# Altium schematic sheet ADS1248.SchDoc
size A4
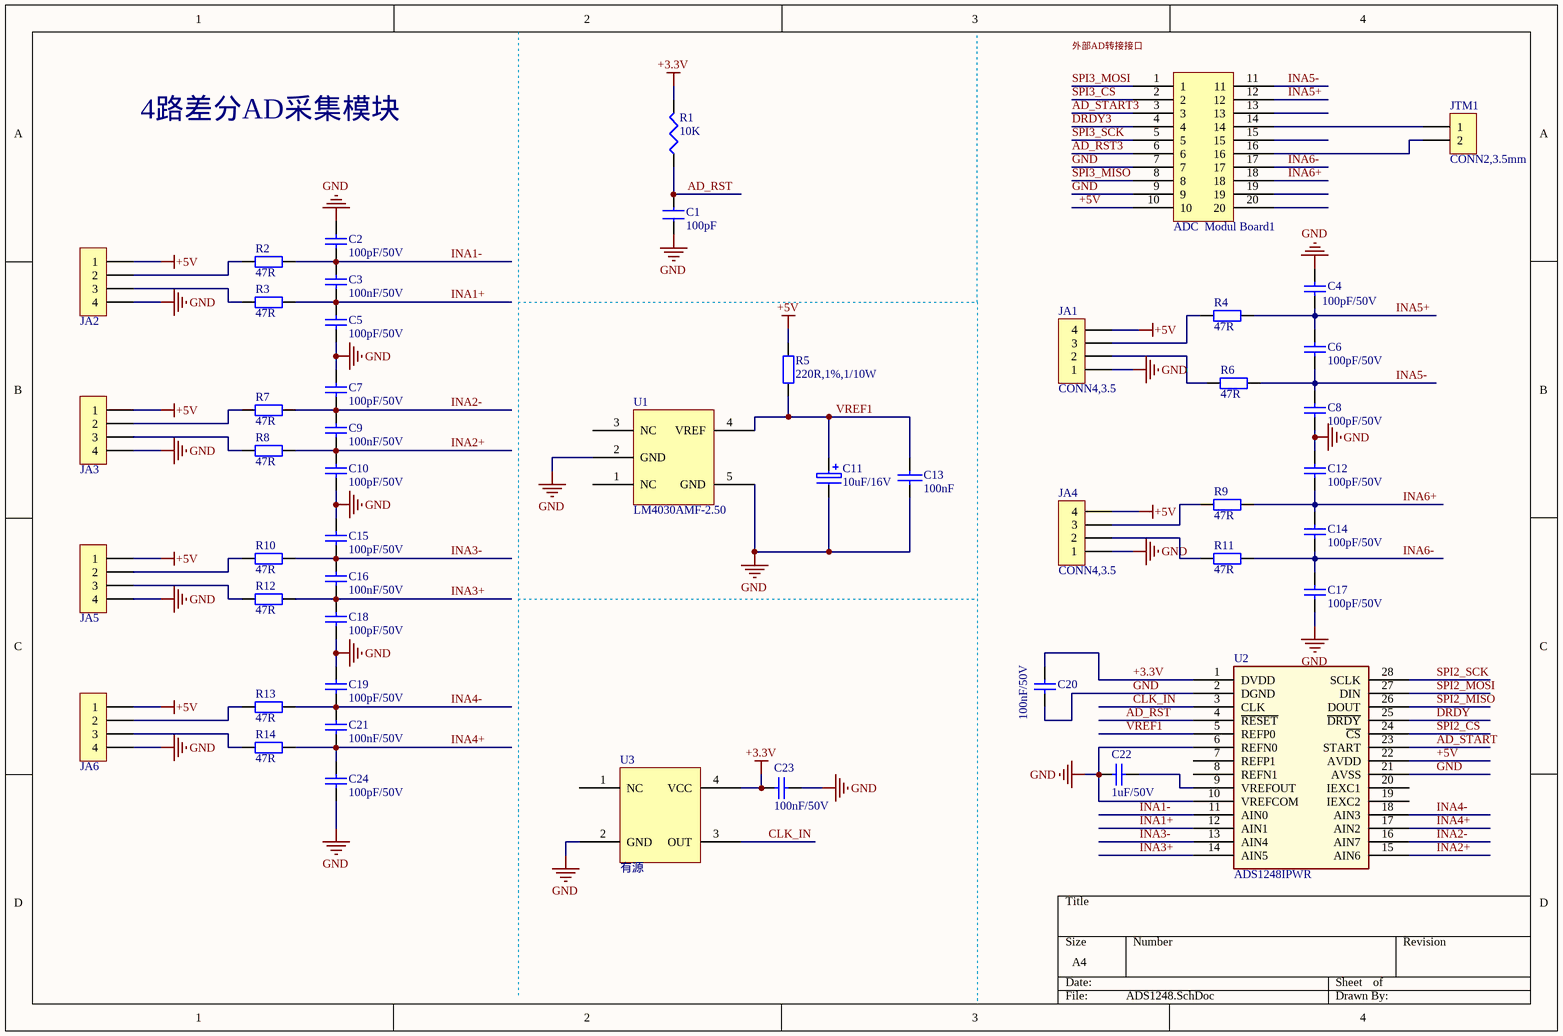
[diagram p0: ADS1248.SchDoc]

## Parts
ADC_Modul_Board1  ADC  Modul Board  [ADC  Modul Board]  (value not drawn)
C1  100pF  [0603C]
C2  100pF/50V  [0603C]
C3  100nF/50V  [0603C]
C4  100pF/50V  [0603C]
C5  100pF/50V  [0603C]
C6  100pF/50V  [0603C]
C7  100pF/50V  [0603C]
C8  100pF/50V  [0603C]
C9  100nF/50V  [0603C]
C10  100pF/50V  [0603C]
C11  10uF/16V  [3216]
C12  100pF/50V  [0603C]
C13  100nF  [0603C]
C14  100pF/50V  [0603C]
C15  100pF/50V  [0603C]
C16  100nF/50V  [0603C]
C17  100pF/50V  [0603C]
C18  100pF/50V  [0603C]
C19  100pF/50V  [0603C]
C20  100nF/50V  [0603C]
C21  100nF/50V  [0603C]
C22  1uF/50V  [0603C]
C23  100nF/50V  [0603C]
C24  100pF/50V  [0603C]
JA1  CONN4,3.5  [CN4-3.5]
JA2  XH-4A  [CN4-3.5]  (value not drawn)
JA3  XH-4A  [CN4-3.5]  (value not drawn)
JA4  CONN4,3.5  [CN4-3.5]
JA5  XH-4A  [CN4-3.5]  (value not drawn)
JA6  XH-4A  [CN4-3.5]  (value not drawn)
JTM1  CONN2,3.5mm  [KF124-2P-3.5]
R1  10K  [0603R]
R2  47R  [0603R]
R3  47R  [0603R]
R4  47R  [0603R]
R5  220R,1%,1/10W  [0603R]
R6  47R  [0603R]
R7  47R  [0603R]
R8  47R  [0603R]
R9  47R  [0603R]
R10  47R  [0603R]
R11  47R  [0603R]
R12  47R  [0603R]
R13  47R  [0603R]
R14  47R  [0603R]
U1  LM4030AMF-2.50  [SOT23-5]
U2  ADS1248IPWR  [SSOP28]
U3  有源  [ECS-3953C]

## Nets
+3.3V: C20.2 C23.2 R1.2 U2.1(DVDD) U3.4(VCC)
+5V: ADC_Modul_Board1.10 JA1.4 JA2.1 JA3.1 JA4.4 JA5.1 JA6.1 R5.1 U2.22(AVDD)
GND: ADC_Modul_Board1.7 ADC_Modul_Board1.9 C1.2 C2.2 C4.2 C5.1 C7.2 C8.1 C10.1 C11.2 C12.2 C13.2 C15.2 C17.1 C18.1 C19.2 C20.1 C22.1 C23.1 C24.1 JA1.1 JA2.4 JA3.4 JA4.1 JA5.4 JA6.4 U1.2(GND) U1.5(GND) U2.2(DGND) U2.6(REFN0) U2.10(VREFCOM) U2.21(AVSS) U3.2(GND)
AD_RST: C1.1 R1.1 U2.4(~{RESET})
AD_RST3: ADC_Modul_Board1.6
AD_START: U2.23(START)
AD_START3: ADC_Modul_Board1.3
CLK_IN: U2.3(CLK) U3.3(OUT)
DRDY: U2.25(~{DRDY})
DRDY3: ADC_Modul_Board1.4
INA1+: C3.1 C5.2 R3.2 U2.12(AIN1)
INA1-: C2.1 C3.2 R2.2 U2.11(AIN0)
INA2+: C9.1 C10.2 R8.2 U2.15(AIN6)
INA2-: C7.1 C9.2 R7.2 U2.16(AIN7)
INA3+: C16.1 C18.2 R12.2 U2.14(AIN5)
INA3-: C15.1 C16.2 R10.2 U2.13(AIN4)
INA4+: C21.1 C24.2 R14.2 U2.17(AIN2)
INA4-: C19.1 C21.2 R13.2 U2.18(AIN3)
INA5+: ADC_Modul_Board1.12 C4.1 C6.2 R4.2
INA5-: ADC_Modul_Board1.11 C6.1 C8.2 R6.2
INA6+: ADC_Modul_Board1.18 C12.1 C14.2 R9.2
INA6-: ADC_Modul_Board1.17 C14.1 C17.2 R11.2
SPI2_CS: U2.24(~{CS})
SPI2_MISO: U2.26(DOUT)
SPI2_MOSI: U2.27(DIN)
SPI2_SCK: U2.28(SCLK)
SPI3_CS: ADC_Modul_Board1.2
SPI3_MISO: ADC_Modul_Board1.8
SPI3_MOSI: ADC_Modul_Board1.1
SPI3_SCK: ADC_Modul_Board1.5
VREF1: C11.1 C13.1 R5.2 U1.4(VREF) U2.5(REFP0)
NetADC_Modul_Board1_14: ADC_Modul_Board1.14 JTM1.1
NetADC_Modul_Board1_16: ADC_Modul_Board1.16 JTM1.2
NetC22_2: C22.2 U2.9(VREFOUT)
NetJA1_2: JA1.2 R6.1
NetJA1_3: JA1.3 R4.1
NetJA2_2: JA2.2 R2.1
NetJA2_3: JA2.3 R3.1
NetJA3_2: JA3.2 R7.1
NetJA3_3: JA3.3 R8.1
NetJA4_2: JA4.2 R11.1
NetJA4_3: JA4.3 R9.1
NetJA5_2: JA5.2 R10.1
NetJA5_3: JA5.3 R12.1
NetJA6_2: JA6.2 R13.1
NetJA6_3: JA6.3 R14.1

Not connected (* = marked no-connect by the designer): ADC_Modul_Board1 13 15 19 20; U1 1(NC) 3(NC); U2 7(REFP1) 8(REFN1) 19(IEXC2) 20(IEXC1); U3 1(NC)

## Notes on the sheet
- 外部AD转接接口
- 4路差分AD采集模块

## Library data of the parts
C1 = 电容: Capacitor; Value: 100nF
C2 C4-C8 C10 C12 C14 C15 C17-C19 C24 = C100pF/50V-0603: 瓷片电容,100pF,5%,X7R,50V,0603; 料号: 10201-10002-00; 品名: 瓷片电容
C3 C9 C16 C20 C21 C23 = C100nF/50V-0603: 瓷片电容,100nF,5%,X7R,50V,0603; 料号: 10201-10032-00; 品名: 瓷片电容
C11 = CAP2
C13 = CAP
C22 = C1uF/50V-0603: 瓷片电容,1uF,5%,X7R,50V,0603; 料号: 10201-10042-00; 品名: 瓷片电容
JA1 JA4 = KF2EDGV-Y-3.5-4P-14: 凤凰端子，KF2EDGV-Y-3.5-4P-14，4PIN，3.5mm，公母头套装; 料号: 10701-00104-00; 品名: 线对板连接器
JA2 JA3 JA5 JA6 = CON4
JTM1 = KF2EDGR3.5-2P: KF2EDGR3.5-2P，插座; 料号: 10701-00091-00; 品名: 线对板连接器
R1 R5 = RES1
R2-R4 R6-R14 = R47R-0603: 金属膜电阻,47R,1%,1/10W,0603; 料号: 10101-04702-00; 品名: 金属膜电阻
U1 = LM4030: Voltage adj; Published: 8-Jun-2000; LatestRevisionDate: 29-May-2009; LatestRevisionNote: IPC-7351 Footprint Added.; PackageVersion: Aug-1999; PackageReference: SOT-23B; Publisher: Altium Limited; PackageDescription: 3-Pin SOT-23 Package 0.95 mm Pitch, 2.4 mm Lead Span
U2 = ADS1248IPWR: IC，ADS1248IPWR，SSOP28; 料号: 10605-00006-9G; 品名: 数据转换芯片
U3 = ECS-3953C-250-TR: 有源晶振，ECS-3953C-250-TR,7.5*5.0; 料号: 11402-00001-00; 品名: 有源晶振